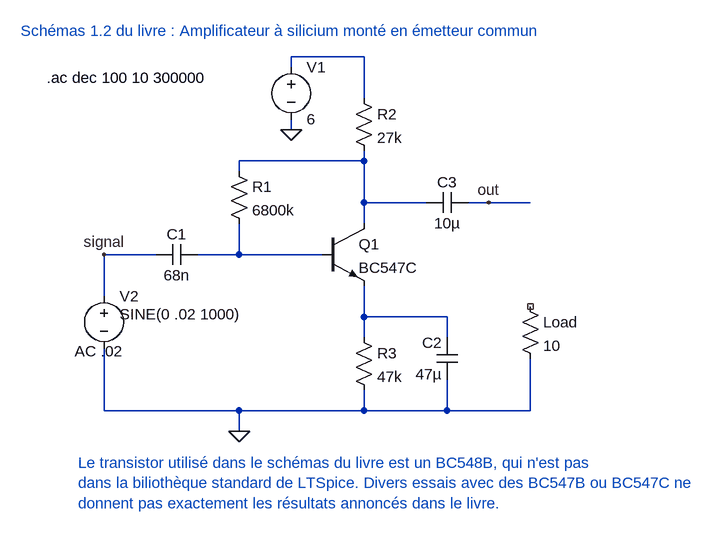
[diagram p0: schematic 1_2-AmpliEmeteurCommun.asc]
1_2-AmpliEmeteurCommun.asc, the LTspice schematic file:
Version 4
SHEET 1 1436 760
WIRE 880 64 768 64
WIRE 768 80 768 64
WIRE 880 128 880 64
WIRE 768 176 768 160
WIRE 880 224 880 208
WIRE 880 224 688 224
WIRE 688 240 688 224
WIRE 880 288 880 224
WIRE 976 288 880 288
WIRE 1072 288 1040 288
WIRE 1136 288 1072 288
WIRE 880 320 880 288
WIRE 560 368 480 368
WIRE 688 368 688 320
WIRE 688 368 624 368
WIRE 816 368 688 368
WIRE 480 432 480 368
WIRE 880 464 880 416
WIRE 1008 464 880 464
WIRE 880 496 880 464
WIRE 1008 496 1008 464
WIRE 480 608 480 512
WIRE 688 608 480 608
WIRE 880 608 880 576
WIRE 880 608 688 608
WIRE 1008 608 1008 560
WIRE 1008 608 880 608
WIRE 1136 608 1136 528
WIRE 1136 608 1008 608
WIRE 688 640 688 608
FLAG 768 176 0
FLAG 688 640 0
FLAG 1072 288 out
FLAG 480 368 signal
SYMBOL npn 816 320 R0
SYMATTR InstName Q1
SYMATTR Value BC547C
SYMBOL voltage 768 64 R0
WINDOW 123 0 0 Left 0
WINDOW 39 0 0 Left 0
SYMATTR InstName V1
SYMATTR Value 6
SYMBOL voltage 480 416 R0
WINDOW 123 -45 101 Left 2
WINDOW 39 0 0 Left 0
WINDOW 3 24 44 Left 2
SYMATTR Value2 AC .02
SYMATTR InstName V2
SYMATTR Value SINE(0 .02 1000)
SYMBOL res 672 224 R0
SYMATTR InstName R1
SYMATTR Value 6800k
SYMBOL res 864 112 R0
SYMATTR InstName R2
SYMATTR Value 27k
SYMBOL res 864 480 R0
SYMATTR InstName R3
SYMATTR Value 47k
SYMBOL cap 624 352 R90
WINDOW 0 0 32 VBottom 2
WINDOW 3 32 32 VTop 2
SYMATTR InstName C1
SYMATTR Value 68n
SYMBOL cap 1024 560 R180
WINDOW 0 24 56 Left 2
WINDOW 3 24 8 Left 2
SYMATTR InstName C2
SYMATTR Value 47µ
SYMBOL cap 976 304 R270
WINDOW 0 32 32 VTop 2
WINDOW 3 0 32 VBottom 2
SYMATTR InstName C3
SYMATTR Value 10µ
SYMBOL res 1120 432 R0
SYMATTR InstName Load
SYMATTR Value 10
TEXT 352 24 Left 2 ;Schémas 1.2 du livre : Amplificateur à silicium monté en émetteur commun
TEXT 392 96 Left 2 !.ac dec 100 10 300000
TEXT 440 688 Left 2 ;Le transistor utilisé dans le schémas du livre est un BC548B, qui n'est pas\ndans la biliothèque standard de LTSpice. Divers essais avec des BC547B ou BC547C ne\ndonnent pas exactement les résultats annoncés dans le livre.

The netlist it stands for:
* 1_2-AmpliEmeteurCommun.asc
Q1 N002 N003 N004 0 BC547C
V1 N001 0 6
V2 signal 0 SINE(0 .02 1000) AC .02
R1 N002 N003 6800k
R2 N001 N002 27k
R3 N004 0 47k
C1 N003 signal 68n
C2 0 N004 47µ
C3 N002 out 10µ
R§Load NC_01 0 10
.model NPN NPN
.model PNP PNP
.lib standard.bjt
* Schémas 1.2 du livre : Amplificateur à silicium monté en émetteur commun
.ac dec 100 10 300000
* Le transistor utilisé dans le schémas du livre est un BC548B, qui n'est pas
* dans la biliothèque standard de LTSpice. Divers essais avec des BC547B ou BC547C ne
* donnent pas exactement les résultats annoncés dans le livre.
.backanno
.end